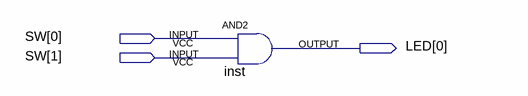
[diagram p0: schematic sheet]
// Quartus schematic Lab.bdf as structural Verilog: 1 symbols, 3 pins
module Lab (
  input  [1:0] SW,
  output [0:0] LED
);

  and inst (LED[0], SW[0], SW[1]);
endmodule
